# EAGLE schematic MRF24J40MA_Breakout (EAGLE 6.4)
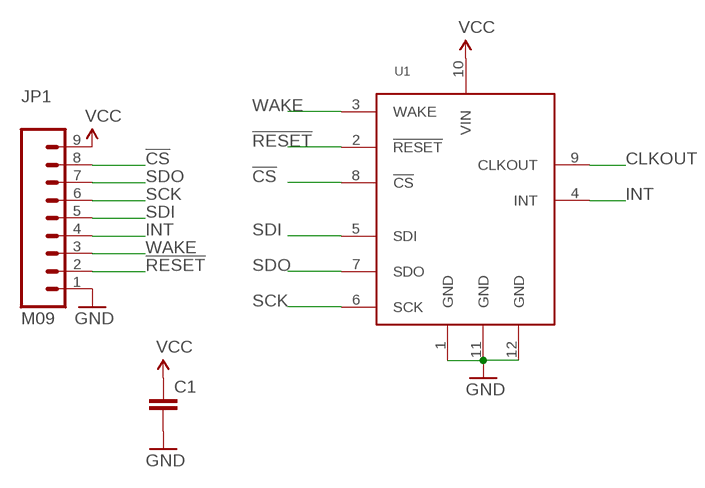
[diagram p0: schematic, sheet 1]

## Parts
C1  CAP0603-CAP  [0603-CAP]
JP1  M09  [1X09]
U1  MRF24J40MA"  [MRF24J40MA]

## Nets
!CS: JP1.8 U1.8(!CS)
!RESET: JP1.2 U1.2(!RESET)
CLKOUT: U1.9(CLKOUT)
GND: C1.2 JP1.1 U1.1(GND) U1.11(GND) U1.12(GND)
INT: JP1.4 U1.4(INT)
SCK: JP1.6 U1.6(SCK)
SDI: JP1.5 U1.5(SDI)
SDO: JP1.7 U1.7(SDO)
VCC: C1.1 JP1.9 U1.10(VIN)
WAKE: JP1.3 U1.3(WAKE)

## Library data of the parts
C1 = SparkFun-Passives:CAP: Capacitor Standard 0603 ceramic capacitor, and 0.1" leaded capacitor.
JP1 = SparkFun-Connectors:M09: Header 9 Standard 9-pin 0.1" header. Use with straight break away headers (SKU : PRT-00116), right angle break away headers (PRT-00553), swiss pins (PRT-00743), machine pins (PRT-00117), and female headers (PRT-00115).
U1 = genericpackages:MRF24J40MA: Microchips MRF24J40MA zigbee module.